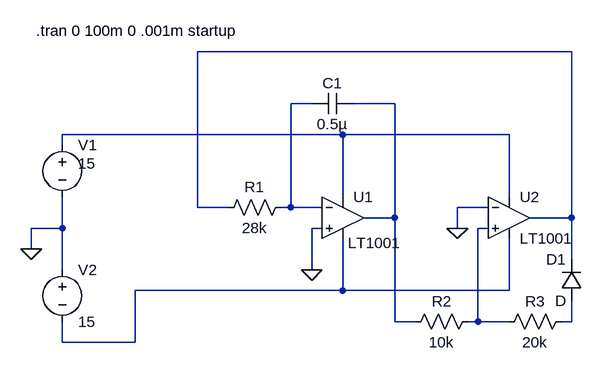
[diagram p0: schematic cuadrada_triangular2.asc]
cuadrada_triangular2.asc, the LTspice schematic file:
Version 4
SHEET 1 880 680
WIRE 528 -96 -48 -96
WIRE 128 -16 96 -16
WIRE 256 -16 192 -16
WIRE 176 32 -256 32
WIRE 432 32 176 32
WIRE -256 48 -256 32
WIRE 176 128 176 32
WIRE 432 128 432 32
WIRE -48 144 -48 -96
WIRE 0 144 -48 144
WIRE 96 144 96 -16
WIRE 96 144 80 144
WIRE 144 144 96 144
WIRE 400 144 352 144
WIRE 256 160 256 -16
WIRE 256 160 208 160
WIRE 528 160 528 -96
WIRE 528 160 464 160
WIRE -256 176 -256 128
WIRE -256 176 -304 176
WIRE 144 176 128 176
WIRE 352 176 352 144
WIRE 400 176 384 176
WIRE -304 208 -304 176
WIRE 528 224 528 160
WIRE -256 240 -256 176
WIRE 128 240 128 176
WIRE 176 272 176 192
WIRE 176 272 -144 272
WIRE 432 272 432 192
WIRE 432 272 176 272
WIRE 256 320 256 160
WIRE 288 320 256 320
WIRE 384 320 384 176
WIRE 384 320 368 320
WIRE 432 320 384 320
WIRE 528 320 528 288
WIRE 528 320 512 320
WIRE -256 352 -256 320
WIRE -144 352 -144 272
WIRE -144 352 -256 352
FLAG 128 240 0
FLAG -304 208 0
FLAG 352 176 0
SYMBOL Opamps\\LT1001 176 96 R0
WINDOW 3 8 103 Left 2
SYMATTR InstName U1
SYMBOL Opamps\\LT1001 432 96 R0
SYMATTR InstName U2
SYMBOL res 96 128 R90
WINDOW 0 0 56 VBottom 2
WINDOW 3 32 56 VTop 2
SYMATTR InstName R1
SYMATTR Value 28k
SYMBOL res 384 304 R90
WINDOW 0 0 56 VBottom 2
WINDOW 3 32 56 VTop 2
SYMATTR InstName R2
SYMATTR Value 10k
SYMBOL res 528 304 R90
WINDOW 0 0 56 VBottom 2
WINDOW 3 32 56 VTop 2
SYMATTR InstName R3
SYMATTR Value 20k
SYMBOL cap 192 -32 R90
WINDOW 0 0 32 VBottom 2
WINDOW 3 32 32 VTop 2
SYMATTR InstName C1
SYMATTR Value 0.5µ
SYMBOL voltage -256 32 R0
WINDOW 123 0 0 Left 2
WINDOW 39 0 0 Left 2
WINDOW 3 24 44 Left 2
SYMATTR Value 15
SYMATTR InstName V1
SYMBOL voltage -256 224 R0
WINDOW 123 0 0 Left 2
WINDOW 39 0 0 Left 2
SYMATTR InstName V2
SYMATTR Value 15
SYMBOL diode 544 288 R180
WINDOW 0 24 64 Left 2
WINDOW 3 24 0 Left 2
SYMATTR InstName D1
TEXT -296 -128 Left 2 !.tran 0 100m 0 .001m startup

The netlist it stands for:
* cuadrada_triangular2.asc
XU1 0 N002 N004 N006 N003 LT1001  ; pins In+ In- V+ V- OUT
XU2 N005 0 N004 N006 N001 LT1001  ; pins In+ In- V+ V- OUT
R1 N002 N001 28k
R2 N005 N003 10k
R3 N007 N005 20k
C1 N003 N002 0.5µ
V1 N004 0 15
V2 0 N006 15
D1 N007 N001 D
.model D D
.lib standard.dio
.tran 0 100m 0 .001m startup
.lib LTC.lib
.backanno
.end